# EAGLE schematic controller (EAGLE 9.6.2)

## Sheet 1 of 2: Logic
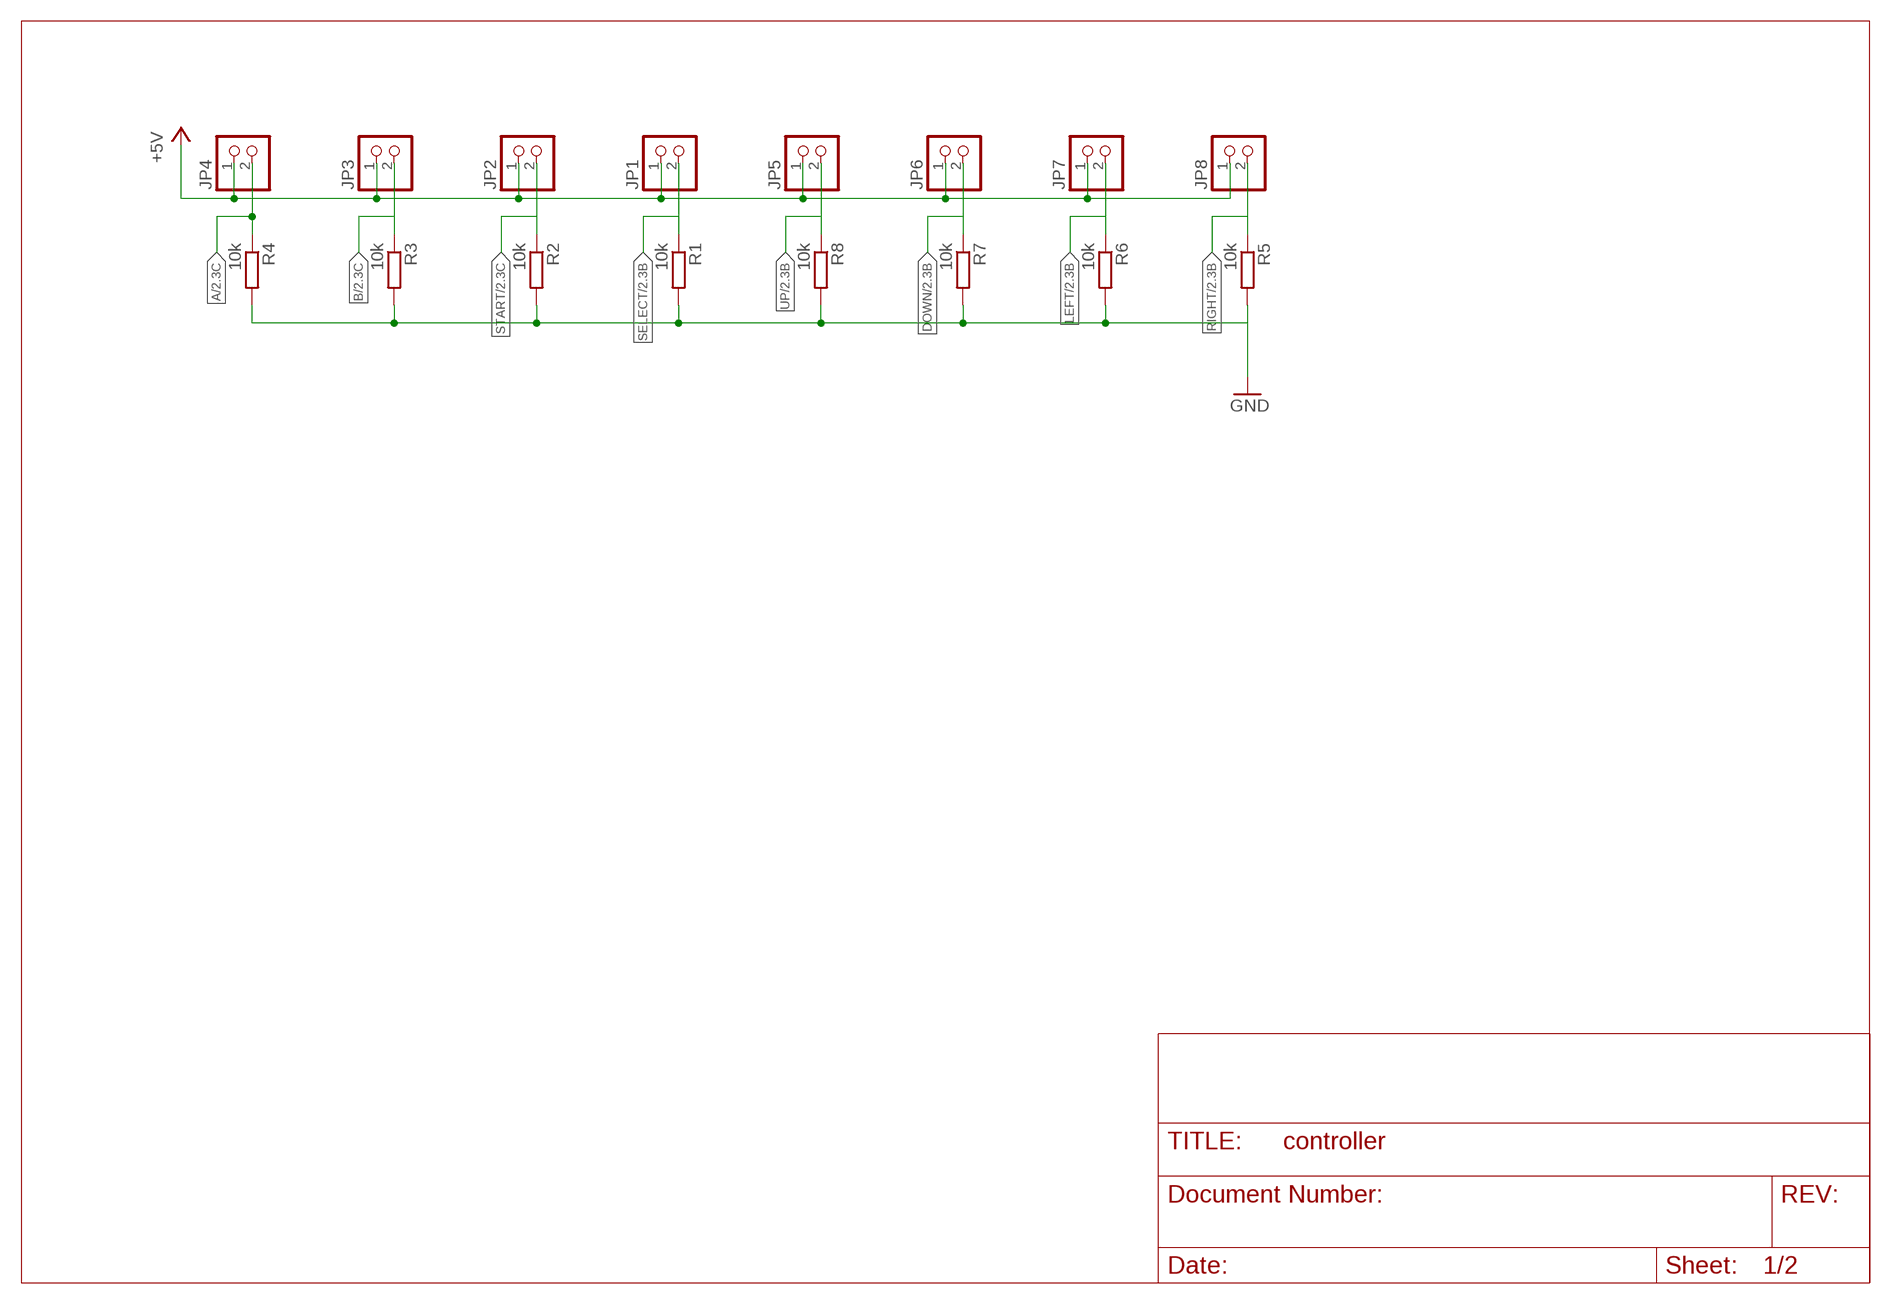
[diagram p0: schematic, sheet 1]

### Parts
JP1  PINHD-1X2  [1X02]
JP2  PINHD-1X2  [1X02]
JP3  PINHD-1X2  [1X02]
JP4  PINHD-1X2  [1X02]
JP5  PINHD-1X2  [1X02]
JP6  PINHD-1X2  [1X02]
JP7  PINHD-1X2  [1X02]
JP8  PINHD-1X2  [1X02]
R1  10k  R-EU_R0805  [R0805]
R2  10k  R-EU_R0805  [R0805]
R3  10k  R-EU_R0805  [R0805]
R4  10k  R-EU_R0805  [R0805]
R5  10k  R-EU_R0805  [R0805]
R6  10k  R-EU_R0805  [R0805]
R7  10k  R-EU_R0805  [R0805]
R8  10k  R-EU_R0805  [R0805]

### Nets
+5V: JP1.1 JP2.1 JP3.1 JP4.1 JP5.1 JP6.1 JP7.1 JP8.1 ; also sheet 2
A: JP4.2 R4.1 ; also sheet 2
N$1: JP1.2 R1.1
N$2: JP2.2 R2.1
N$4: JP3.2 R3.1
N$7: JP8.2 R5.1
N$8: JP7.2 R6.1
N$9: JP6.2 R7.1
N$11: R1.2 R2.2 R3.2 R4.2 R5.2 R6.2 R7.2 R8.2
UP: JP5.2 R8.1 ; also sheet 2

## Sheet 2 of 2: Power & I/O
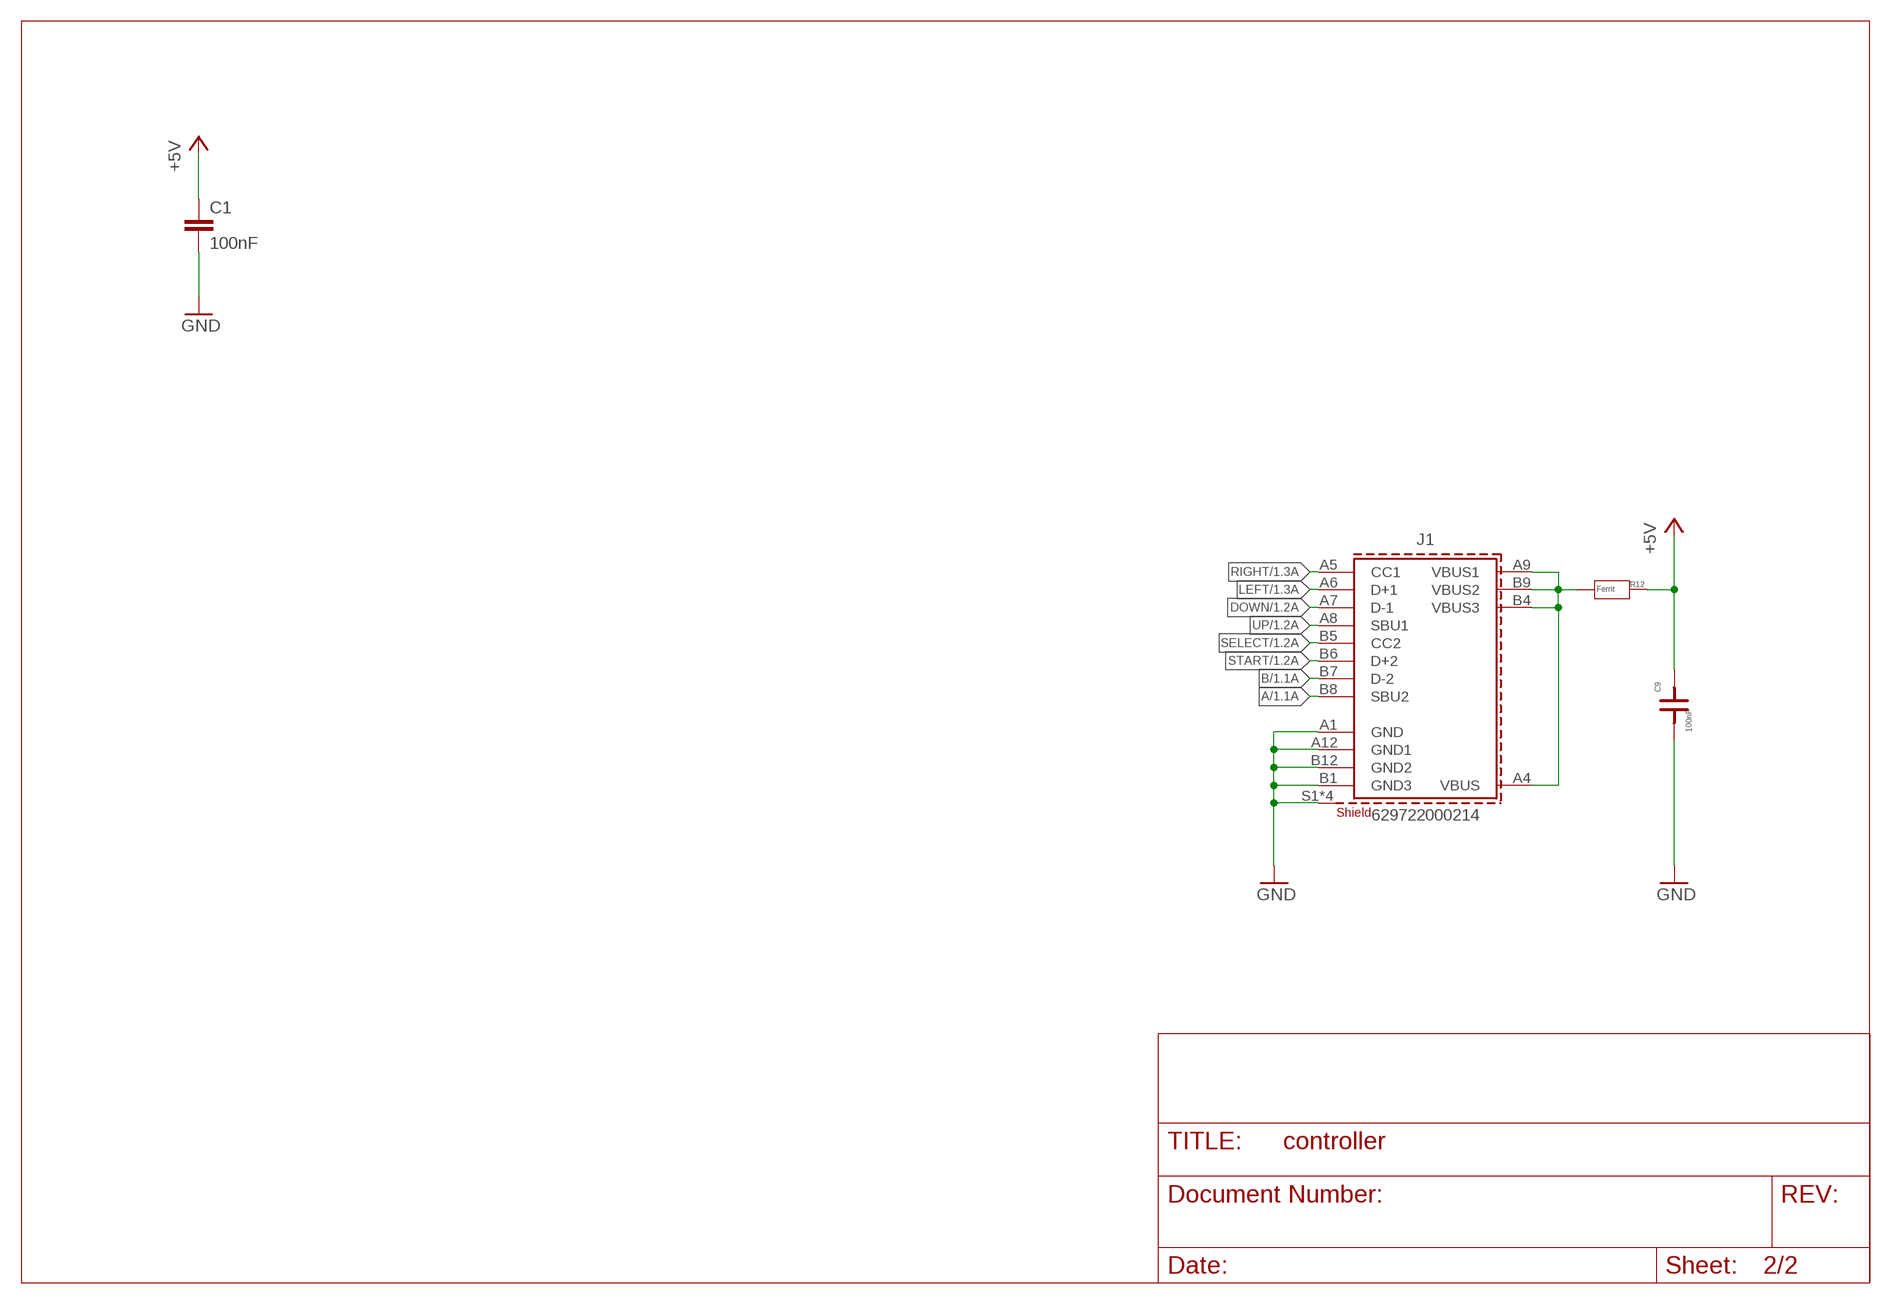
[diagram p1: schematic, sheet 2]

### Parts
C1  100nF  C-EUC0805  [C0805]
C9  100nF  C1  [0805F]
J1  629722000214  [629722000214]
R12  Ferrit  R2  [1206]

### Nets
+3.3V: C1.1 ; supply symbol labelled +5V
+5V: C9.2 R12.2 ; also sheet 1
A: J1.B8(SBU2) ; also sheet 1
B: J1.B7(D-2) ; also sheet 1
DOWN: J1.A7(D-1) ; also sheet 1
GND: C1.2 C9.1 J1.A1(GND) J1.A12(GND1) J1.B1(GND3) J1.B12(GND2) J1.S1(SHIELD) J1.S2(SHIELD) J1.S3(SHIELD) J1.S4(SHIELD) ; also sheet 1
LEFT: J1.A6(D+1) ; also sheet 1
N$3: J1.A4(VBUS) J1.A9(VBUS1) J1.B4(VBUS3) J1.B9(VBUS2) R12.1
RIGHT: J1.A5(CC1) ; also sheet 1
SELECT: J1.B5(CC2) ; also sheet 1
START: J1.B6(D+2) ; also sheet 1
UP: J1.A8(SBU1) ; also sheet 1

## Library data of the parts
C1 = rcl:C-EU: CAPACITOR, European symbol; SPICEPREFIX: C
C9 = deto:C
J1 = Eagle_WR-USB (rev22c):629722000214: WR-COM USB 2.0 Type C Plug Vertical SMT Kind Properties Durability 10 000 Mating cycles Gender Receptacle Type Horizontal General Information Operating Temperature -40 up to +85 °C Electrical Properties Working Voltage 20 V (DC) Withstanding Voltage 100 V (AC) Contact Resistance 40 mΩ Material Properties Insulator Material LCP Insulator Flammability Rating UL94 V-0 Insulator Color Black Contact Material Brass Contact Plating Gold over Nickel Contact Type Stamped Shielding Material Steel Shielding Plating Nickel (Ni) <https://www.we-online.com/catalog/media/o689297v209%20family-wr-com-629722000214.jpg> Details see: www.we-online.com/catalog/WR-COM_USB_20_TYPE_C_RECEPTACLE_HORIZONTAL_SMT <www.we-online.com/catalog/WR-COM_USB_20_TYPE_C_RECEPTACLE_HORIZONTAL_SMT/?utm_source=eagle_model&utm_medium=description_link&utm_campaign=eisos_eagle> Updated by Ella Wu 2022-11-15 2022 (C) Würth Elektronik; APPLICATION: USB 2.0; DATASHEET-URL: https://www.we-online.com/redexpert/spec/629722000214?ae; GERDER: Receptacle; INTERFACE-TYPE: Type C; IR: 5A; MOUNT: SMT; PACKAGING: Tape and Reel; PART-NUMBER: 629722000214; PINS: 16; TYPE: Horizontal; WORKING-VOLTAGE: 20V(AC)
JP1-JP8 = pinhead:PINHD-1X2: PIN HEADER
R1-R8 = rcl:R-EU_: RESISTOR, European symbol; SPICEPREFIX: R
R12 = deto:R: Widerstand 400 mil - 0805 - 1206